# Altium project cardio.PrjPcb
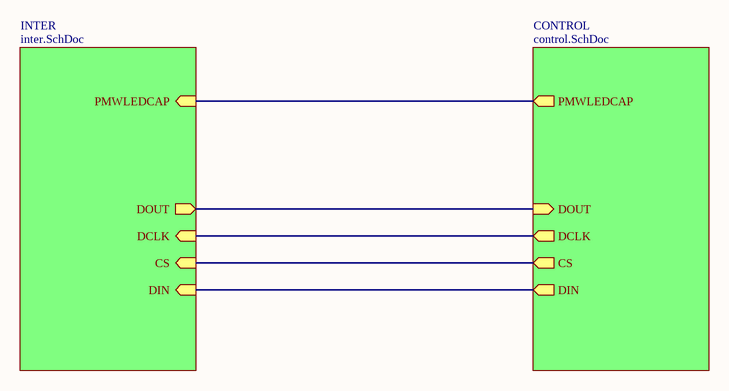
[diagram p0: cardio.SchDoc]
3 sheets, 111 parts. Net scope: hierarchical (ports join the sheet entries above them; power ports are global).
Board file: cardio_pcb_gnd40.PcbDoc
Sheets:
  cardio.SchDoc
    INTER = inter.SchDoc
    CONTROL = control.SchDoc

## Sheet cardio.SchDoc
size A4

### Sub-sheets
CONTROL = control.SchDoc: PMWLEDCAP (out), DOUT (in), DCLK (out), CS (out), DIN (out)
INTER = inter.SchDoc: PMWLEDCAP (in), DOUT (out), DCLK (in), CS (in), DIN (in)

### Nets
NetR38_1: sheet INTER/PMWLEDCAP, sheet CONTROL/PMWLEDCAP
NetU5_79: sheet INTER/DCLK, sheet CONTROL/DCLK
NetU5_84: sheet INTER/DIN, sheet CONTROL/DIN
NetU5_85: sheet INTER/DOUT, sheet CONTROL/DOUT
NetU5_88: sheet INTER/CS, sheet CONTROL/CS

## Sheet inter.SchDoc
size B
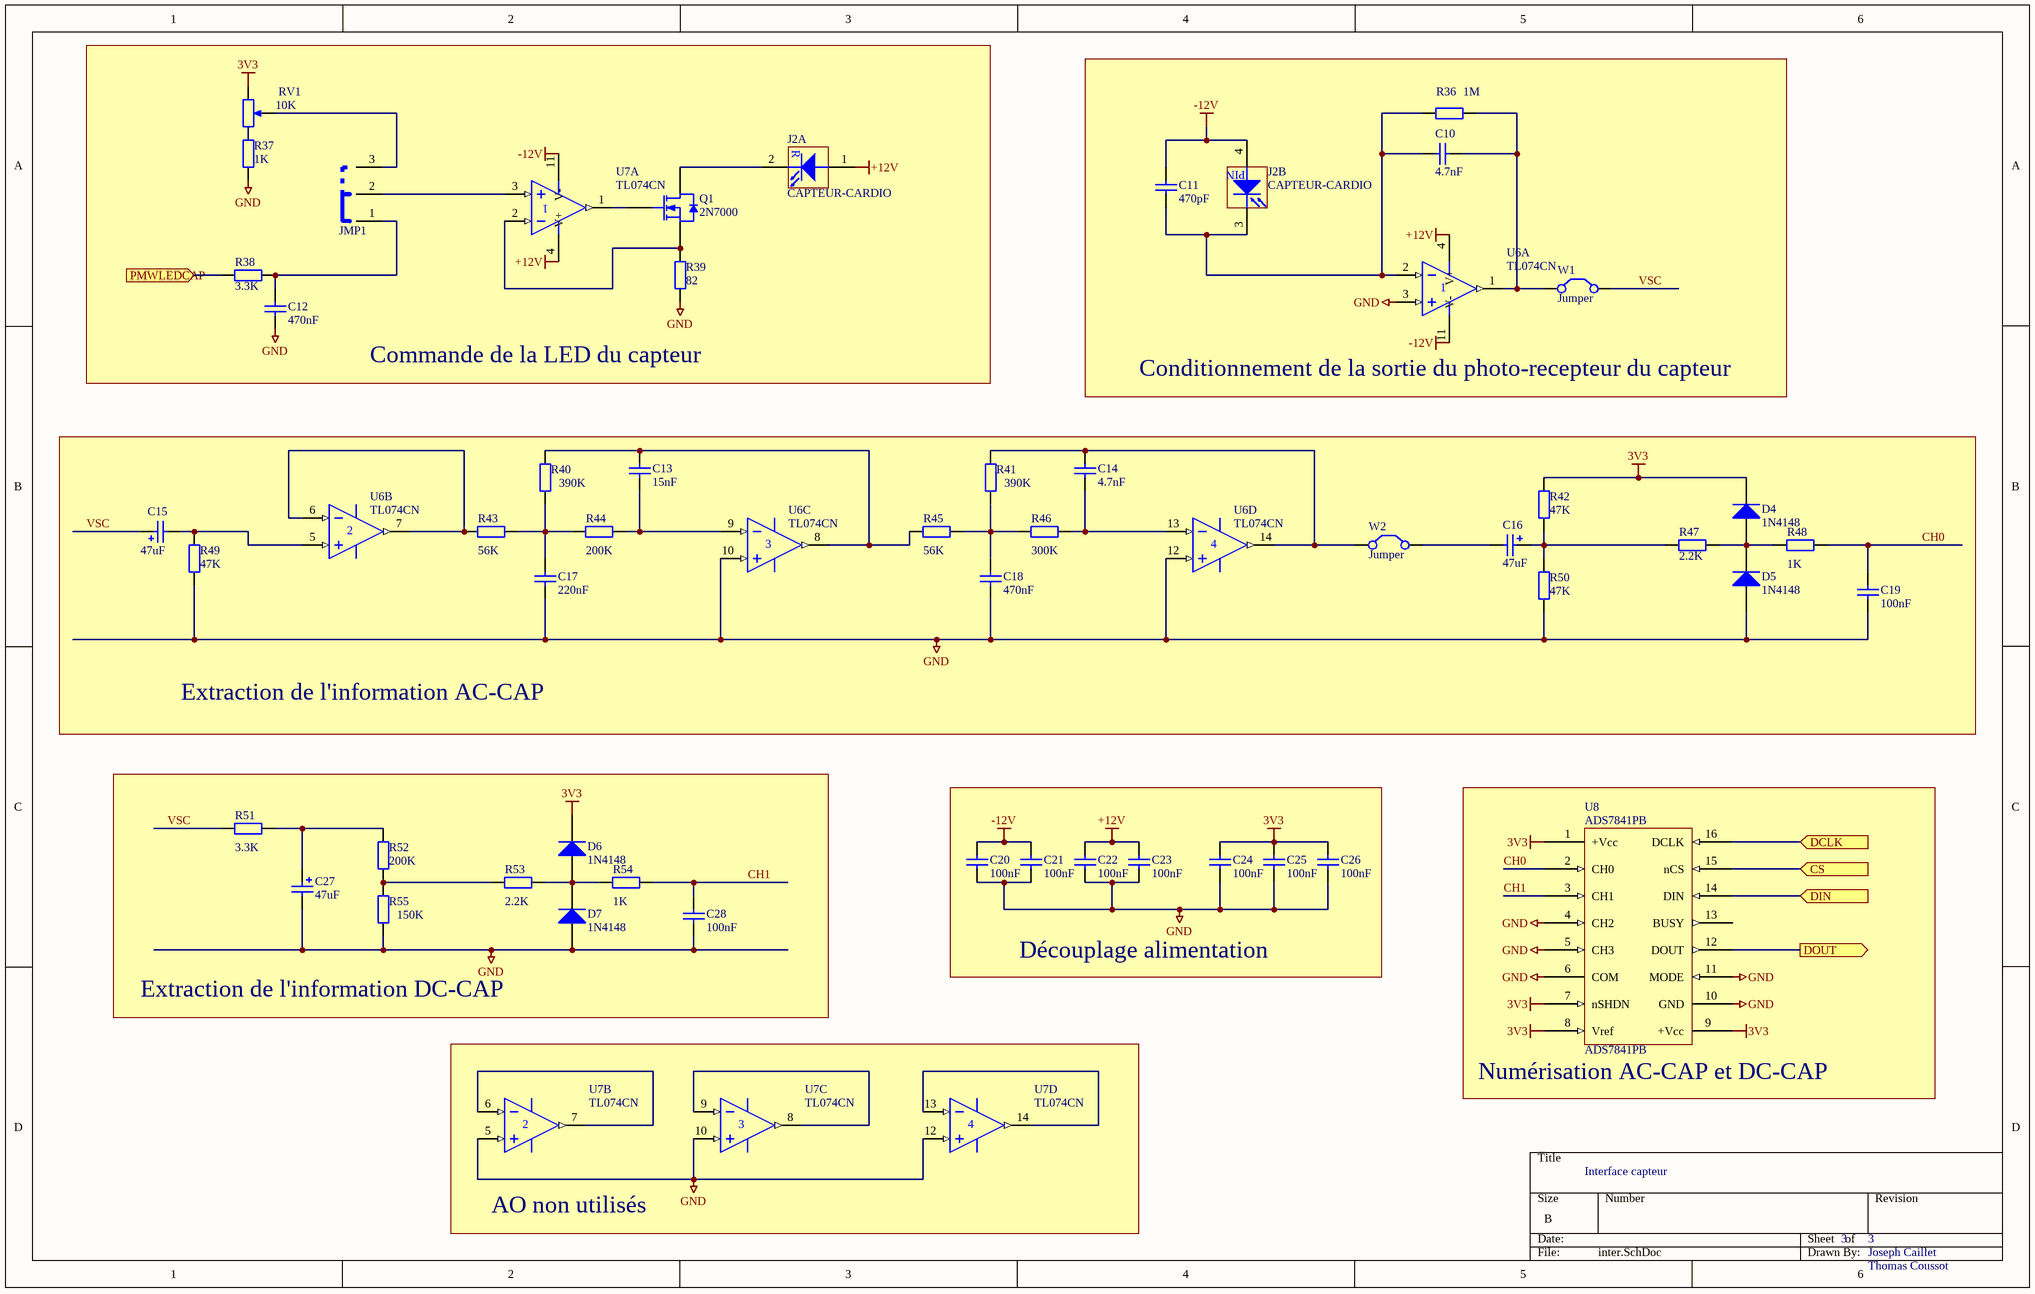
[diagram p1: inter.SchDoc]

### Parts
C10  4.7nF  [rad-0.2-bot]
C11  470pF  [rad-0.2-bot]
C12  470nF  [rad-0.2-bot]
C13  15nF  [rad-0.2-bot]
C14  4.7nF  [rad-0.2-bot]
C15  47uF  [RAD-0.2-BOT]
C16  47uF  [RAD-0.2-BOT]
C17  220nF  [rad-0.2-bot]
C18  470nF  [rad-0.2-bot]
C19  100nF  [rad-0.2]
C20  100nF  [rad-0.2]
C21  100nF  [rad-0.2]
C22  100nF  [rad-0.2]
C23  100nF  [rad-0.2]
C24  100nF  [rad-0.2]
C25  100nF  [rad-0.2]
C26  100nF  [rad-0.2]
C27  47uF  [RAD-0.2-BOT]
C28  100nF  [rad-0.2]
D4  1N4148  [diode-0.4]
D5  1N4148  [diode-0.4]
D6  1N4148  [diode-0.4]
D7  1N4148  [diode-0.4]
J2  CAPTEUR-CARDIO  [KK-1X4M]  (parts A,B of 2)
JMP1  JUMPER-INV  [JMP3-INV-0.1]  (value not drawn)
Q1  2N7000  [NMOS-TO92]
R36  1M  [axial-0.4]
R37  1K  [axial-0.4]
R38  3.3K  [axial-0.4]
R39  82  [axial-0.4]
R40  390K  [axial-0.4]
R41  390K  [axial-0.4]
R42  47K  [axial-0.4]
R43  56K  [axial-0.4]
R44  200K  [axial-0.4]
R45  56K  [axial-0.4]
R46  300K  [axial-0.4]
R47  2.2K  [axial-0.4]
R48  1K  [axial-0.4]
R49  47K  [axial-0.4]
R50  47K  [axial-0.4]
R51  3.3K  [axial-0.4]
R52  200K  [axial-0.4]
R53  2.2K  [axial-0.4]
R54  1K  [axial-0.4]
R55  150K  [axial-0.4]
RV1  10K  [VR-3386F-T]
U6  TL074CN  [dip-14]  (parts A,B,C,D of 4)
U7  TL074CN  [dip-14]  (parts A,B,C,D of 4)
U8  ADS7841PB  [DIP-16]
W1  Jumper  [JMP2-0.1]
W2  Jumper  [JMP2-0.1]

### Blocks framed on the sheet
Commande de la LED du capteur: C12 J2 JMP1 Q1 R37-R39 RV1 U7
Conditionnement de la sortie du photo-recepteur du capteur: C10 C11 J2 R36 U6 W1
Extraction de l'information AC-CAP: C13-C19 D4 D5 R40-R50 U6 W2
Extraction de l'information DC-CAP: C27 C28 D6 D7 R51-R55
Découplage alimentation: C20-C26
Numérisation AC-CAP et DC-CAP: U8
AO non utilisés: U7

### Ports
CS (in), DCLK (in), DIN (in), DOUT (out), PMWLEDCAP (in)

### Nets
3V3: C24.2 C25.2 C26.2 D4.2(K) D6.2(K) R42.2 RV1.2(BOT) U8.1(+Vcc) U8.7(nSHDN) U8.8(Vref) U8.9(+Vcc)
+12V: C22.2 C23.2 J2.1(A-R) U6.4(V+) U7.4(V+)
-12V: C11.2 C20.2 C21.2 J2.4(A-DET) U6.11(V-) U7.11(V-)
GND: C12.1 C17.2 C18.2 C19.1 C20.1 C21.1 C22.1 C23.1 C24.1 C25.1 C26.1 C27.2 C28.1 D5.1(A) D7.1(A) R37.1 R39.2 R49.1 R50.1 R55.2 U6.3(IN+) U6.10(IN+) U6.12(IN+) U7.5(IN+) U7.10(IN+) U7.12(IN+) U8.4(CH2) U8.5(CH3) U8.6(COM) U8.10(GND) U8.11(MODE)
CH0: C19.2 R48.1 U8.2(CH0)
CH1: C28.2 R54.1 U8.3(CH1)
VSC: C15.1 R51.2 W1.2(C2)
NetC10_1: C10.1 R36.2 U6.1(OUT) W1.1(C1)
NetC10_2: C10.2 C11.1 J2.3(K-DET) R36.1 U6.2(IN-)
NetC12_2: C12.2 JMP1.1 R38.2
NetC13_1: C13.1 R40.2 R45.2 U6.8(OUT)
NetC13_2: C13.2 R44.2 U6.9(IN-)
NetC14_1: C14.1 R41.2 U6.14(OUT) W2.1(C1)
NetC14_2: C14.2 R46.2 U6.13(IN-)
NetC15_2: C15.2 R49.2 U6.5(IN+)
NetC16_1: C16.1 R42.1 R47.2 R50.2
NetC16_2: C16.2 W2.2(C2)
NetC17_1: C17.1 R40.1 R43.1 R44.1
NetC18_1: C18.1 R41.1 R45.1 R46.1
NetC27_1: C27.1 R51.1 R52.1
NetD4_1: D4.1(A) D5.2(K) R47.1 R48.2
NetD6_1: D6.1(A) D7.2(K) R53.1 R54.2
NetJ2_2: J2.2(K-R) Q1.1(D)
NetJMP1_2: JMP1.2 U7.3(IN+)
NetJMP1_3: JMP1.3 RV1.3(TAP)
NetQ1_2: Q1.2(G) U7.1(OUT)
NetQ1_3: Q1.3(S) R39.1 U7.2(IN-)
NetR37_2: R37.2 RV1.1(TOP)
NetR38_1: R38.1 ; port PMWLEDCAP
NetR43_2: R43.2 U6.6(IN-) U6.7(OUT)
NetR52_2: R52.2 R53.2 R55.1
NetU5_79: U8.16(DCLK) ; port DCLK
NetU5_84: U8.14(DIN) ; port DIN
NetU5_85: U8.12(DOUT) ; port DOUT
NetU5_88: U8.15(nCS) ; port CS
NetU7_6: U7.6(IN-) U7.7(OUT)
NetU7_8: U7.8(OUT) U7.9(IN-)
NetU7_13: U7.13(IN-) U7.14(OUT)

Not connected (* = marked no-connect by the designer): U8 13(BUSY)

### Notes on the sheet
- Interface capteur
- 3
- Joseph Caillet
- Thomas Coussot
- (in symbol CAPTEUR-CARDIO, part A) R
- (in symbol CAPTEUR-CARDIO, part B) PIN

### Library data of the parts
C10-C14 C17 C18 = Cap: Capacitor Polyester 5%; Published: 8-Jun-2000; LatestRevisionDate: 17-Jul-2002; LatestRevisionNote: Re-released for DXP Platform.; PackageReference: RAD-0.3; Publisher: Altium Limited; PackageDescription: Radial Cap, Thru-Hole; 2 Leads; 0.3 in Pin Spacing
  C10 C14: Value: 4.7nF
  C11: Value: 470pF
  C12 C18: Value: 470nF
  C13: Value: 15nF
  C17: Value: 220nF
C15 C16 C27 = Cap Pol1: Polarized Capacitor (Axial); Published: 8-Jun-2000; LatestRevisionDate: 17-Jul-2002; LatestRevisionNote: Re-released for DXP Platform.; PackageReference: RB7.6-15; Publisher: Altium Limited; PackageDescription: Polarized Capacitor (Radial); 2 Leads; Value: 47uF
C19-C26 C28 = Cap: Capacitor Céramique Multicouche X7R 50V RadialPas=5.08mm 50%; Published: 8-Jun-2000; LatestRevisionDate: 17-Jul-2002; LatestRevisionNote: Re-released for DXP Platform.; PackageReference: RAD-0.3; Publisher: Altium Limited; PackageDescription: Radial Cap, Thru-Hole; 2 Leads; 0.3 in Pin Spacing; Value: 100nF
D4-D7 = 1N4148: High Conductance Fast Diode; Published: 8-Jun-2000; LatestRevisionDate: 17-Jul-2002; LatestRevisionNote: Re-released for DXP Platform.; DatasheetDocument: 1997; PackageReference: DO-35; Publisher: Altium Limited; Code_JEDEC: DO-204-AH; ComponentLink1Description: Manufacturer Link; ComponentLink1URL: http://www.fairchildsemi.com/; ComponentLink2Description: Datasheet; ComponentLink2URL: http://www.fairchildsemi.com/ds/1N%2F1N4148.pdf
J2 = CAPTEUR-CARDIO: CAPTEUR CARDIO
JMP1 = JUMPER-INV: JUMPER INVERSEUR HE14 MALE 3 cts
Q1 = 2N7000: N-channel Enhancement Mode Field-effect Transistor; Published: 17-Sep-2003; LatestRevisionDate: 12-Dec-2006; LatestRevisionNote: Footprint pad sequence fixed.; DatasheetVersion: 19-May-2000; PackageVersion: Feb-1997; PackageReference: SOT54; Publisher: Altium Limited; PackageDescription: Plastic Single-Ended Leaded (through hole) package; 3 Leads (TO-92); Code_JEITA: SC-43; Code_JEDEC: TO-92; ComponentLink1Description: Manufacturer Link; ComponentLink1URL: http://www.semiconductors.philips.com/; ComponentLink2Description: Datasheet; ComponentLink2URL: http://www.semiconductors.philips.com/acrobat/datasheets/2N7000-03.pdf
R36 R40-R47 R49-R51 = Res2: Resistor 1% Couche métallique 0.4W Axial L=7mm; Published: 8-Jun-2000; LatestRevisionDate: 17-Jul-2002; LatestRevisionNote: Re-released for DXP Platform.; PackageReference: AXIAL-0.4; Publisher: Altium Limited; PackageDescription: Axial Device, Thru-Hole; 2 Leads; 0.4 in Pin Spacing
  R36: Value: 1M
  R40 R41: Value: 390K
  R42 R49 R50: Value: 47K
  R43 R45: Value: 56K
  R44: Value: 200K
  R46: Value: 300K
  R47: Value: 2.2K
  R51: Value: 3.3K
R37-R39 R48 R52-R55 = Res2: Resistor 5% Couche métallique 0.4W Axial L=7mm; Published: 8-Jun-2000; LatestRevisionDate: 17-Jul-2002; LatestRevisionNote: Re-released for DXP Platform.; PackageReference: AXIAL-0.4; Publisher: Altium Limited; PackageDescription: Axial Device, Thru-Hole; 2 Leads; 0.4 in Pin Spacing
  R37 R48 R54: Value: 1K
  R38: Value: 3.3K
  R39: Value: 82
  R52: Value: 200K
  R53: Value: 2.2K
  R55: Value: 150K
RV1 = R-TRIM: TRIMMER PRECISION POTENTIOMETER; Manufacturer: Bourns/Vishay; Class I: Passive; Set Position: 0.5; Class II: Potentiometer; Value: 10K
U6 U7 = TL074CN: Low-Noise JFET-Input Operational Amplifier; Manufacturer: Texas/Motorola; Published: 17-Jul-2002; LatestRevisionDate: 06-Jun-2005; LatestRevisionNote: Stylized 3D Model Added.; DatasheetVersion: 1988; PackageVersion: 1997; PackageReference: 646-06; Publisher: Altium Limited; PackageDescription: DIP; 14 Leads; Row Spacing 7.62 mm; Pitch 2.54 mm; ComponentLink1Description: Manufacturer Link; ComponentLink1URL: http://www.onsemi.com/site/products/parametrics/0,4446,251,00.html
U8 = ADS7841PB: Analog to Digital converter; Manufacturer: TEXAS
W1 W2 = Jumper: Jumper Wire; Published: 24-Mar-1999; LatestRevisionDate: 17-Jul-2002; LatestRevisionNote: Re-released for DXP Platform.; PackageReference: RAD-0.2; Publisher: Altium Limited; PackageDescription: Radial Cap, Thru-Hole; 2 Leads; 0.2 in Pin Spacing

## Sheet control.SchDoc
size B
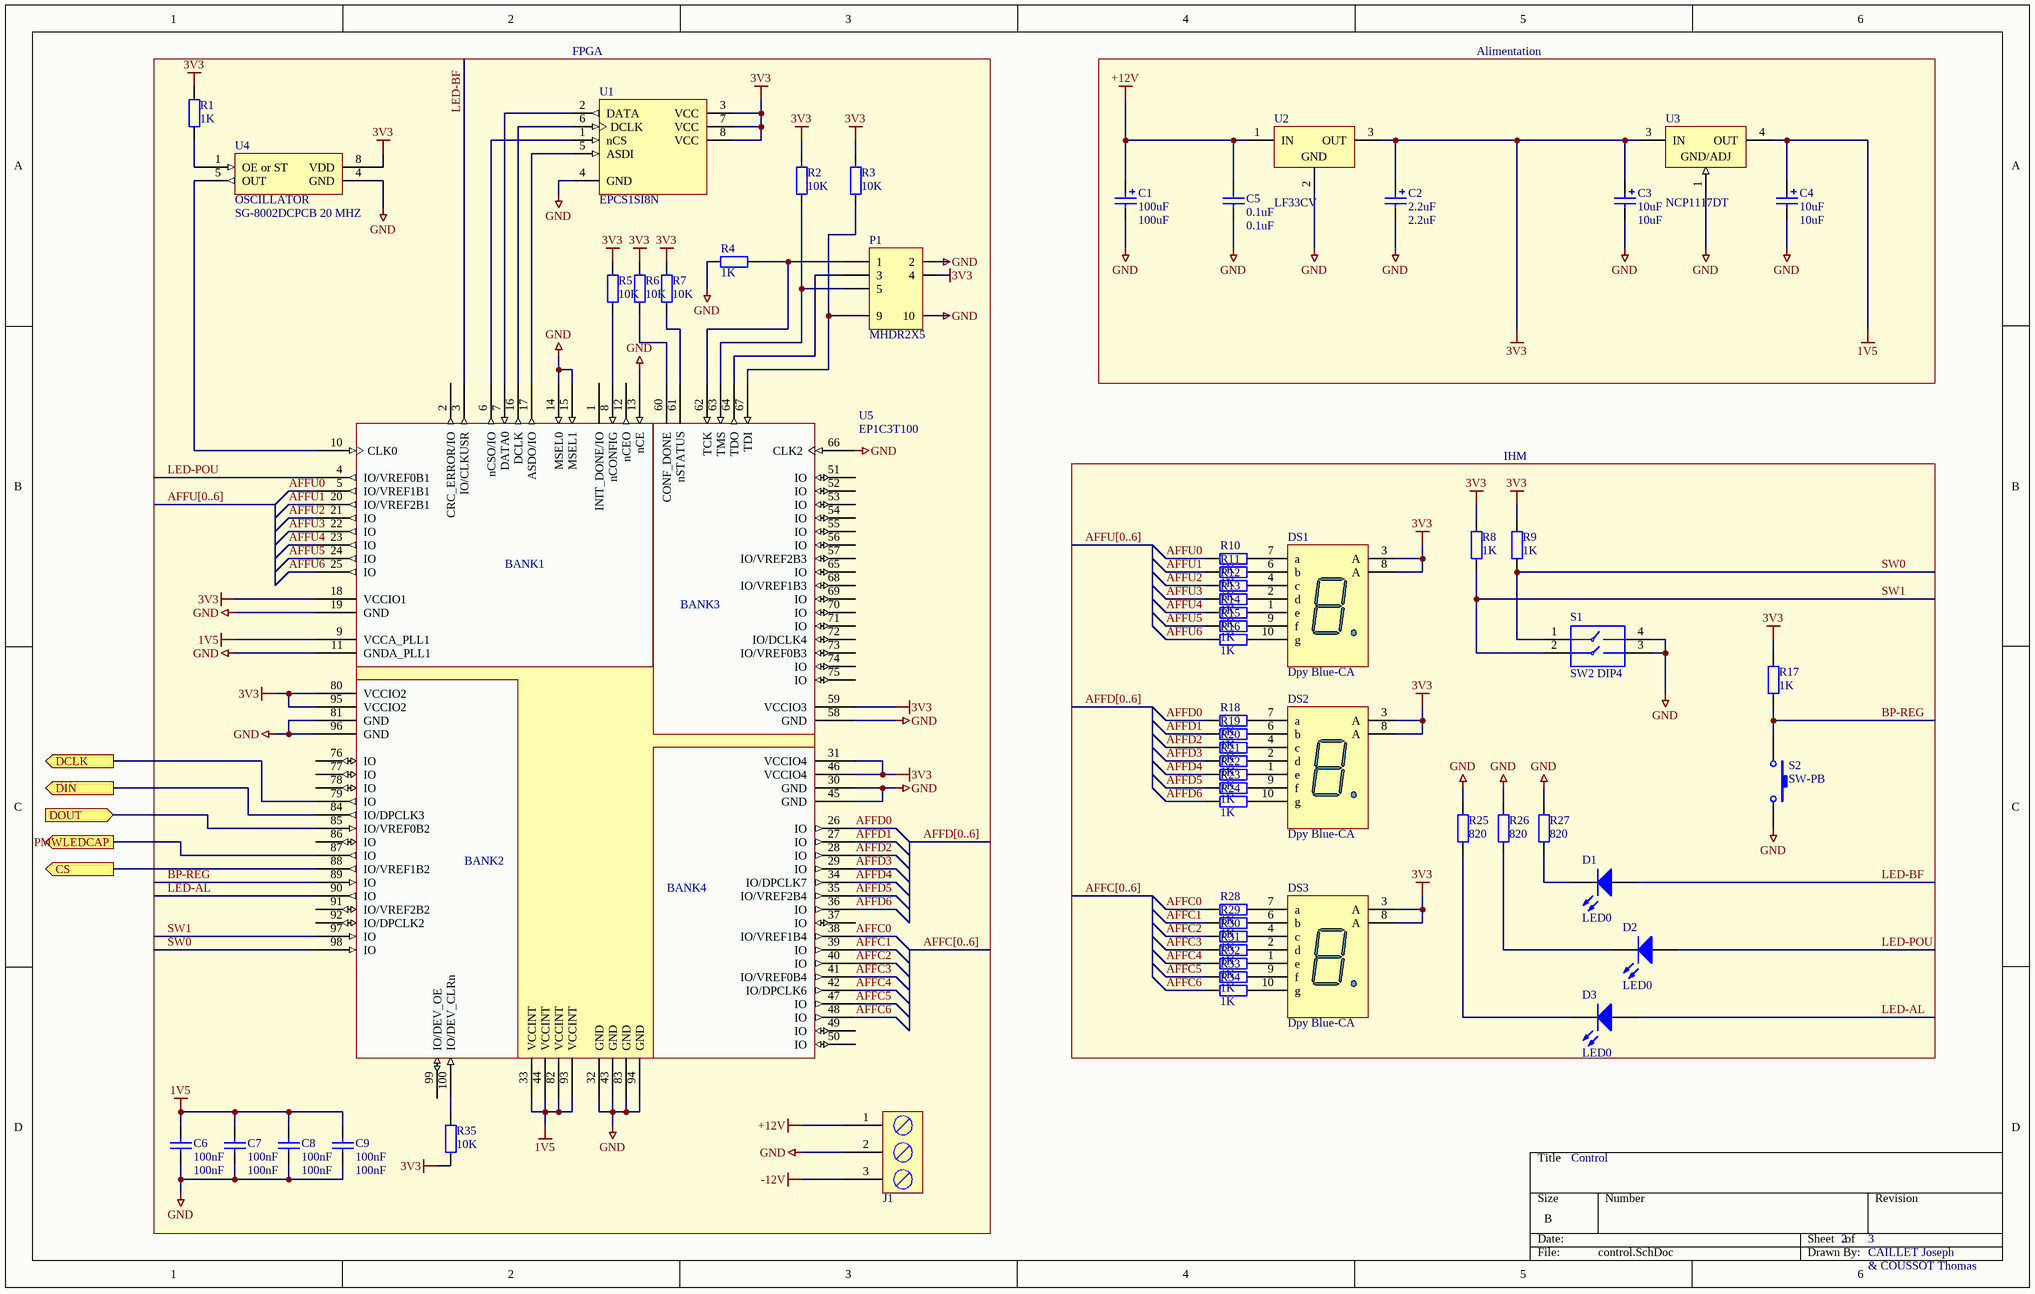
[diagram p2: control.SchDoc]

### Parts
C1  100uF  [RB0.14/0.35]
C2  2.2uF  [RB0.1/0.2]
C3  10uF  [RB0.1/0.2]
C4  10uF  [RB0.1/0.2]
C5  0.1uF  [RAD-0.2]
C6  100nF  [RAD-0.2]
C7  100nF  [RAD-0.2]
C8  100nF  [RAD-0.2]
C9  100nF  [RAD-0.2]
D1  LED0  [led-3mm]
D2  LED0  [led-3mm]
D3  LED0  [led-3mm]
DS1  Dpy Blue-CA  [AFF7SEG-14MM]
DS2  Dpy Blue-CA  [AFF7SEG-14MM]
DS3  Dpy Blue-CA  [AFF7SEG-14MM]
J1  BORNIER 3 VIS  [BORNIER-3]  (value not drawn)
P1  MHDR2X5  [HE10-2X5M]
R1  1K  [AXIAL-0.4]
R2  10K  [AXIAL-0.4]
R3  10K  [AXIAL-0.4]
R4  1K  [AXIAL-0.4]
R5  10K  [AXIAL-0.4]
R6  10K  [AXIAL-0.4]
R7  10K  [AXIAL-0.4]
R8  1K  [AXIAL-0.4]
R9  1K  [AXIAL-0.4]
R10  1K  [AXIAL-0.4]
R11  1K  [AXIAL-0.4]
R12  1K  [AXIAL-0.4]
R13  1K  [AXIAL-0.4]
R14  1K  [AXIAL-0.4]
R15  1K  [AXIAL-0.4]
R16  1K  [AXIAL-0.4]
R17  1K  [AXIAL-0.4]
R18  1K  [AXIAL-0.4]
R19  1K  [AXIAL-0.4]
R20  1K  [AXIAL-0.4]
R21  1K  [AXIAL-0.4]
R22  1K  [AXIAL-0.4]
R23  1K  [AXIAL-0.4]
R24  1K  [AXIAL-0.4]
R25  820  [AXIAL-0.4]
R26  820  [AXIAL-0.4]
R27  820  [AXIAL-0.4]
R28  1K  [AXIAL-0.4]
R29  1K  [AXIAL-0.4]
R30  1K  [AXIAL-0.4]
R31  1K  [AXIAL-0.4]
R32  1K  [AXIAL-0.4]
R33  1K  [AXIAL-0.4]
R34  1K  [AXIAL-0.4]
R35  10K  [AXIAL-0.4]
S1  SW2 DIP4  [DIP-4]
S2  SW-PB  [BP-MJTP12]
U1  EPCS1SI8N  [DIP-8]
U2  LF33CV  [REG-TO220]
U3  NCP1117DT  [REG-DPAK]
U4  SG-8002DCPCB 20 MHZ  [DIP-8]
U5  EP1C3T100  [SUPPORT-TQFP100]

### Blocks framed on the sheet
FPGA: C6-C9 J1 P1 R1-R7 R35 U1 U4 U5
Alimentation: C1-C5 U2 U3
IHM: D1-D3 DS1-DS3 R8-R34 S1 S2

### Ports
CS (out), DCLK (out), DIN (out), DOUT (in), PMWLEDCAP (out)

### Nets
1V5: C4.1 C6.2 C7.2 C8.2 C9.2 U3.4(OUT) U5.9(VCCA_PLL1) U5.33(VCCINT) U5.44(VCCINT) U5.82(VCCINT) U5.93(VCCINT)
3V3: C2.1 C3.1 DS1.3(A) DS1.8(A) DS2.3(A) DS2.8(A) DS3.3(A) DS3.8(A) P1.4 R1.1 R2.1 R3.1 R5.1 R6.1 R7.1 R8.2 R9.2 R17.2 R35.2 U1.3(VCC) U1.7(VCC) U1.8(VCC) U2.3(OUT) U3.3(IN) U4.8(VDD) U5.18(VCCIO1) U5.31(VCCIO4) U5.46(VCCIO4) U5.59(VCCIO3) U5.80(VCCIO2) U5.95(VCCIO2)
+12V: C1.1 C5.2 J1.1(X) U2.1(IN)
-12V: J1.3
GND: C1.2 C2.2 C3.2 C4.2 C5.1 C6.1 C7.1 C8.1 C9.1 J1.2 P1.2 P1.10 R4.2 R25.2 R26.2 R27.2 S1.3 S1.4 S2.2 U1.4(GND) U2.2(GND) U3.1(GND/ADJ) U4.4(GND) U5.11(GNDA_PLL1) U5.13(nCE) U5.14(MSEL0) U5.15(MSEL1) U5.19(GND) U5.30(GND) U5.32(GND) U5.43(GND) U5.45(GND) U5.58(GND) U5.66(CLK2) U5.81(GND) U5.83(GND) U5.94(GND) U5.96(GND)
AFFC0: R28.1 U5.38(IO/VREF1B4)
AFFC1: R29.1 U5.39(IO)
AFFC2: R30.1 U5.40(IO)
AFFC3: R31.1 U5.41(IO/VREF0B4)
AFFC4: R32.1 U5.42(IO/DPCLK6)
AFFC5: R33.1 U5.47(IO)
AFFC6: R34.1 U5.48(IO)
AFFD0: R18.1 U5.26(IO)
AFFD1: R19.1 U5.27(IO)
AFFD2: R20.1 U5.28(IO)
AFFD3: R21.1 U5.29(IO)
AFFD4: R22.1 U5.34(IO/DPCLK7)
AFFD5: R23.1 U5.35(IO/VREF2B4)
AFFD6: R24.1 U5.36(IO)
AFFU0: R10.1 U5.5(IO/VREF1B1)
AFFU1: R11.1 U5.20(IO/VREF2B1)
AFFU2: R12.1 U5.21(IO)
AFFU3: R13.1 U5.22(IO)
AFFU4: R14.1 U5.23(IO)
AFFU5: R15.1 U5.24(IO)
AFFU6: R16.1 U5.25(IO)
BP-REG: R17.1 S2.1 U5.89(IO)
LED-AL: D3.1(A) U5.90(IO)
LED-BF: D1.1(A) U5.3(IO/CLKUSR)
LED-POU: D2.1(A) U5.4(IO/VREF0B1)
SW0: R9.1 S1.1 U5.98(IO)
SW1: R8.1 S1.2 U5.97(IO)
NetD1_2: D1.2(K) R27.1
NetD2_2: D2.2(K) R26.1
NetD3_2: D3.2(K) R25.1
NetDS1_1: DS1.1(e) R14.2
NetDS1_2: DS1.2(d) R13.2
NetDS1_4: DS1.4(c) R12.2
NetDS1_6: DS1.6(b) R11.2
NetDS1_7: DS1.7(a) R10.2
NetDS1_9: DS1.9(f) R15.2
NetDS1_10: DS1.10(g) R16.2
NetDS2_1: DS2.1(e) R22.2
NetDS2_2: DS2.2(d) R21.2
NetDS2_4: DS2.4(c) R20.2
NetDS2_6: DS2.6(b) R19.2
NetDS2_7: DS2.7(a) R18.2
NetDS2_9: DS2.9(f) R23.2
NetDS2_10: DS2.10(g) R24.2
NetDS3_1: DS3.1(e) R32.2
NetDS3_2: DS3.2(d) R31.2
NetDS3_4: DS3.4(c) R30.2
NetDS3_6: DS3.6(b) R29.2
NetDS3_7: DS3.7(a) R28.2
NetDS3_9: DS3.9(f) R33.2
NetDS3_10: DS3.10(g) R34.2
NetP1_1: P1.1 R4.1 U5.62(TCK)
NetP1_3: P1.3 U5.64(TDO)
NetP1_5: P1.5 R2.2 U5.63(TMS)
NetP1_9: P1.9 R3.2 U5.67(TDI)
NetR1_2: R1.2 U4.1(OE_or_ST)
NetR5_2: R5.2 U5.8(nCONFIG)
NetR6_2: R6.2 U5.60(CONF_DONE)
NetR7_2: R7.2 U5.61(nSTATUS)
NetR35_1: R35.1 U5.100(IO/DEV_CLRn)
NetR38_1: U5.87(IO) ; port PMWLEDCAP
NetU1_1: U1.1(nCS) U5.6(nCSO/IO)
NetU1_2: U1.2(DATA) U5.7(DATA0)
NetU1_5: U1.5(ASDI) U5.17(ASDO/IO)
NetU1_6: U1.6(DCLK) U5.16(DCLK)
NetU4_5: U4.5(OUT) U5.10(CLK0)
NetU5_79: U5.79(IO) ; port DCLK
NetU5_84: U5.84(IO/DPCLK3) ; port DIN
NetU5_85: U5.85(IO/VREF0B2) ; port DOUT
NetU5_88: U5.88(IO/VREF1B2) ; port CS

Not connected (* = marked no-connect by the designer): DS1 5(DP); DS2 5(DP); DS3 5(DP); P1 6 7 8; U5 1(INIT_DONE/IO) 2(CRC_ERROR/IO) 12(nCEO) 37(IO) 49(IO) 50(IO) 51(IO) 52(IO) 53(IO) 54(IO) 55(IO) 56(IO) 57(IO/VREF2B3) 65(IO) 68(IO/VREF1B3) 69(IO) 70(IO) 71(IO) 72(IO/DCLK4) 73(IO/VREF0B3) 74(IO) 75(IO) 76(IO) 77(IO) 78(IO) 86(IO) 91(IO/VREF2B2) 92(IO/DPCLK2) 99(IO/DEV_OE)

### Buses and harness runs
bus AFFC[0..6]
bus AFFD[0..6]
bus AFFU[0..6]

### Notes on the sheet
- Control
- 2
- 3
- CAILLET Joseph
- & COUSSOT Thomas
- (in symbol EP1C3T100) BANK1; BANK3; BANK2; BANK4
- (in symbol SG-8002DCPCB 20 MHZ) OSCILLATOR

### Library data of the parts
C1-C4 = Cap Pol2: Electrolytic Polarized Capacitor (Axial); Published: 8-Jun-2000; LatestRevisionDate: 17-Jul-2002; LatestRevisionNote: Re-released for DXP Platform.; PackageReference: POLAR0.8; Publisher: Altium Limited; PackageDescription: Polarized Capacitor; 2 Leads
  C1: Value: 100uF
  C2: Value: 2.2uF
  C3 C4: Value: 10uF
C5-C9 = Cap: Ceramic Multilayer Capacitor; Published: 8-Jun-2000; LatestRevisionDate: 17-Jul-2002; LatestRevisionNote: Re-released for DXP Platform.; PackageReference: RAD-0.3; Publisher: Altium Limited; PackageDescription: Radial Cap, Thru-Hole; 2 Leads; 0.3 in Pin Spacing
  C5: Value: 0.1uF
  C6-C9: Value: 100nF
D1-D3 = LED0: Typical INFRARED GaAs LED; Published: 8-Jun-2000; LatestRevisionDate: 08-Jul-2005; LatestRevisionNote: Mech Layer 1 removed.; PackageReference: LED-0; Publisher: Altium Limited; PackageDescription: LED; 2 Leads
DS1-DS3 = Dpy Blue-CA: 14.2 mm General Purpose Blue 7-Segment Display: CA, RH DP, Gray Surface; MinimumIntensity: 2020 ucd; Note: IF = 10 mA; Published: 8-Jun-2000; LatestRevisionDate: 17-Dec-2003; LatestRevisionNote: Schematic revised, PCB Footprint replaced.; DatasheetVersion: 24-Sep-2002; PackageVersion: 24-Sep-2002; PackageReference: H; Publisher: Altium Limited; PackageDescription: LED, 7-Segment Display, 14.2 mm, RHD; 10 Leads; Row Space 15.24 mm; Pitch 2.54 mm; Colour: Blue; ComponentLink1Description: Manufacturer Link; ComponentLink1URL: http://www.agilent.com/
J1 = BORNIER-3: Bornier 3 cts
P1 = MHDR2X5: Header, 5-Pin, Dual row; LatestRevisionDate: 17-Jul-2002; LatestRevisionNote: Re-released for DXP Platform.; Publisher: Altium Limited
R1-R35 = Res2: Resistor; Published: 8-Jun-2000; LatestRevisionDate: 17-Jul-2002; LatestRevisionNote: Re-released for DXP Platform.; PackageReference: AXIAL-0.4; Publisher: Altium Limited; PackageDescription: Axial Device, Thru-Hole; 2 Leads; 0.4 in Pin Spacing
  R1 R4 R8-R24 R28-R34: Value: 1K
  R2 R3 R5-R7 R35: Value: 10K
  R25-R27: Value: 820
S1 = SW2-DIP4: Dual Switch in DIP 4 pin; Manufacturer: Generic Components; Published: 24-Mar-1999; Revision: July-2002: Re-released for DXP Platform.; Publisher: Altium Limited
S2 = SW-PB: Switch; Published: 24-Mar-1999; LatestRevisionDate: 17-Jul-2002; LatestRevisionNote: Re-released for DXP Platform.; PackageReference: SPST-2; Publisher: Altium Limited; PackageDescription: Switch; 2 Leads
U1 = EPCS1SI8N: EPCS1 Series, In-system programmable 3.3V serial configuration device, 8-Pin SOIC, 1-Megabit, Industrial Grade, Pb-Free; Configures: Cyclone II, Stratix II, & Cyclone Devices; Published: 4-Mar-2005; LatestRevisionDate: 13-Apr-2006; LatestRevisionNote: IPC-7351 Footprint Added.; DatasheetVersion: ver2.0, Oct-2003; PackageVersion: ver14.2, Oct-2005; PackageReference: SOIC8; Publisher: Altium Limited; PackageDescription: 8-Pin Small Outline Integrated Circuit Package (SOIC8); Supplier 1: Digi-Key; Supplier Part Number 1: 544-1242-5-ND; Supplier 2: Farnell; Supplier Part Number 2: 1453504; Code_JEDEC: MS-012-AA; Code_IPC: SOIC127P600-8; ComponentLink1Description: Manufacturer Link; ComponentLink1URL: http://www.altera.com/products/devices/config/cfg-index.html; ComponentLink2Description: Configuration Handbook; ComponentLink2URL: http://www.altera.com/literature/hb/cfg/config_handbook.pdf; ComponentLink3Description: Pinout Specification; ComponentLink3URL: http://www.altera.com/literature/hb/cfg/cyc_c51014.pdf; ComponentLink4Description: Packaging Specification; ComponentLink4URL: http://www.altera.com/literature/ds/dspkg.pdf
U2 = LF33CV: 500mA, Very Low Drop (0.45V) Voltage Regulator; Published: 24-Aug-2001; LatestRevisionDate: 06-Jun-2005; LatestRevisionNote: PCB Pin sequence re-ordered.; DatasheetVersion: Feb-2004; PackageVersion: Jul-2004; PackageReference: TO-220A; Publisher: Altium Limited; PackageDescription: TO, Thru-Hole, Vertical, Heatsink Mounted; 3 In-Line Leads; Pitch 2.54 mm; ComponentLink1Description: Manufacturer Link; ComponentLink1URL: http://www.st.com/; ComponentLink2Description: Datasheet; ComponentLink2URL: http://www.st.com/stonline/books/pdf/docs/2574.pdf
U3 = NCP1117DT: Low drop out Positive Fix. or Adj. Voltage Regulator; Manufacturer: ON Semiconductor; Package Information: Latest Revision: 1997; Class I: Power Management; Note: Pin 2 is electrically connected to Pin 4 (TAB); Pin 2 is trimmed and not drawn; Class II: Voltage Regulator
U4 = SG-8002DCPCB 20 MHZ: OSCILLATOR SG-8002DCPCB 20 MHZ 5V; Manufacturer: EPSON
U5 = EP1C3T100: FPGA CYCLONE 1 TQPF100; Manufacturer: ALTERA

## Nets that join several sheets
3V3: inter (11 pins), control (31 pins)
+12V: inter (5 pins), control (C1.1 C5.2 J1.1 U2.1)
-12V: inter (6 pins), control (J1.3)
GND: inter (31 pins), control (38 pins)
NetR38_1: inter (R38.1), control (U5.87)
NetU5_79: inter (U8.16), control (U5.79)
NetU5_84: inter (U8.14), control (U5.84)
NetU5_85: inter (U8.12), control (U5.85)
NetU5_88: inter (U8.15), control (U5.88)